# Altium project VSD FPGA.PrjPcb
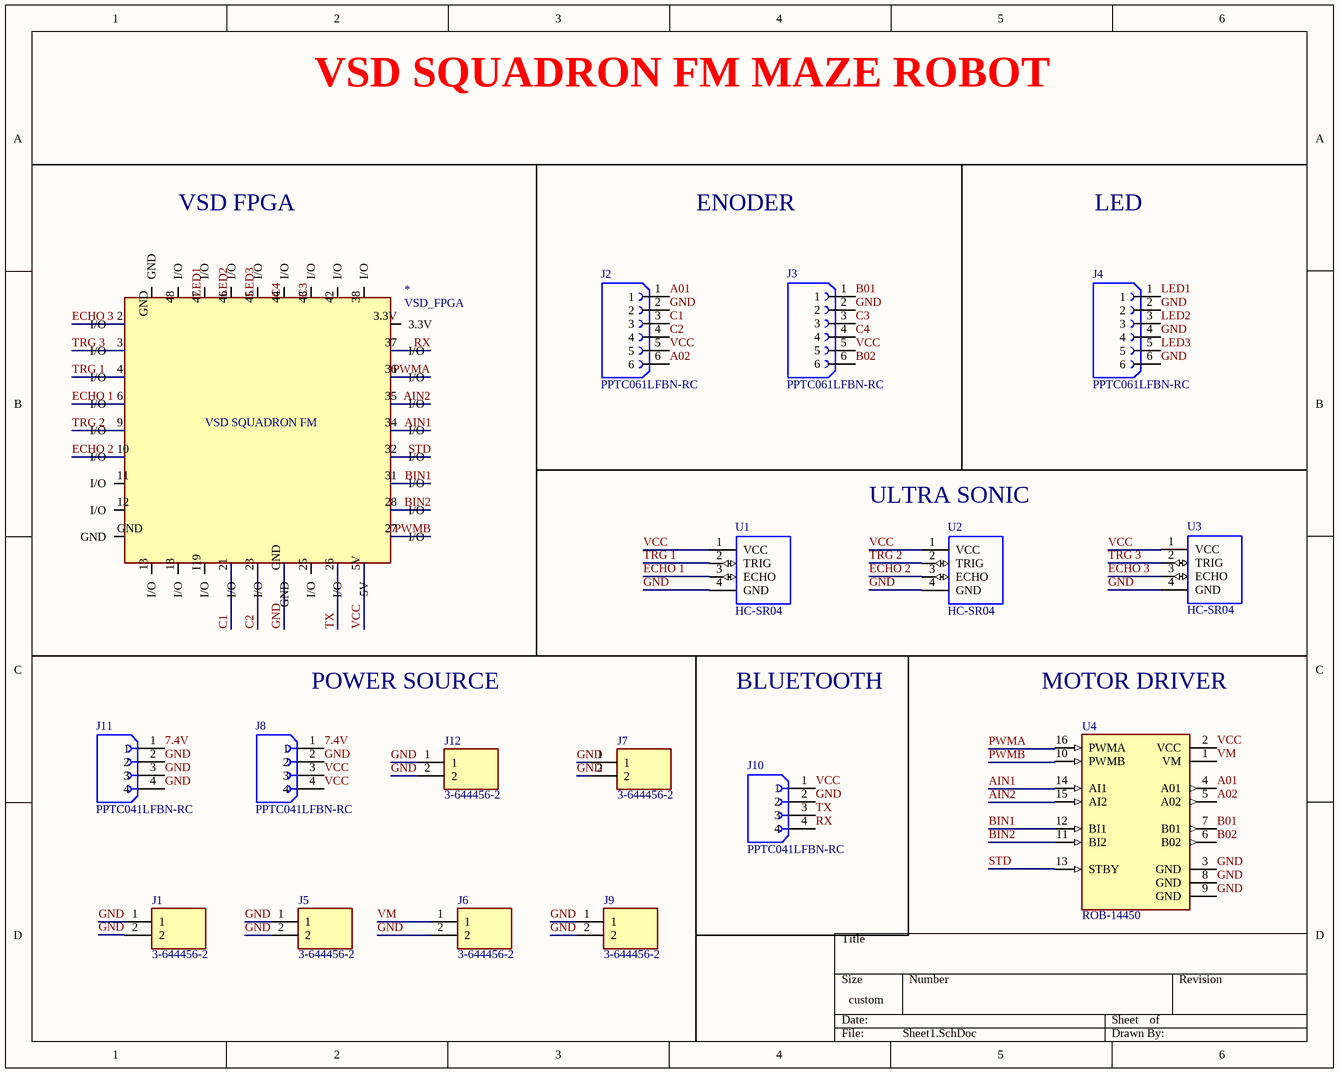
[diagram p0: Sheet1.SchDoc]
1 sheet, 17 parts. Net scope: global (net labels, ports and power ports of the same name join across sheets).
Board file: PCB1.PcbDoc

## Sheet Sheet1.SchDoc
size 250 x 199 mm; SheetNumber: 1; SheetTotal: 1

### Parts
*  VSD_FPGA  [VSD_FPGA2]
J1  3-644456-2  [TE_3-644456-2]
J2  PPTC061LFBN-RC  [SULLINS_PPTC061LFBN-RC]
J3  PPTC061LFBN-RC  [SULLINS_PPTC061LFBN-RC]
J4  PPTC061LFBN-RC  [SULLINS_PPTC061LFBN-RC]
J5  3-644456-2  [TE_3-644456-2]
J6  3-644456-2  [TE_3-644456-2]
J7  3-644456-2  [TE_3-644456-2]
J8  PPTC041LFBN-RC  [SULLINS_PPTC041LFBN-RC]
J9  3-644456-2  [TE_3-644456-2]
J10  PPTC041LFBN-RC  [SULLINS_PPTC041LFBN-RC]
J11  PPTC041LFBN-RC  [SULLINS_PPTC041LFBN-RC]
J12  3-644456-2  [TE_3-644456-2]
U1  HC-SR04  [XCVR_HC-SR04]
U2  HC-SR04  [XCVR_HC-SR04]
U3  HC-SR04  [XCVR_HC-SR04]
U4  ROB-14450  [MODULE_ROB-14450]

### Nets
7.4V: J8.1 J11.1
A01: J2.1 U4.4(A01)
A02: J2.6 U4.5(A02)
AIN1: *.34(I/O) U4.14(AI1)
AIN2: *.35(I/O) U4.15(AI2)
B01: J3.1 U4.7(B01)
B02: J3.6 U4.6(B02)
BIN1: *.31(I/O) U4.12(BI1)
BIN2: *.28(I/O) U4.11(BI2)
C1: *.21(I/O) J2.3
C2: *.23(I/O) J2.4
C3: *.43(I/O) J3.3
C4: *.44(I/O) J3.4
ECHO 1: *.6(I/O) U1.3(ECHO)
ECHO 2: *.10(I/O) U2.3(ECHO)
ECHO 3: *.2(I/O) U3.3(ECHO)
GND: *.GND J1.1 J1.2 J2.2 J3.2 J4.2 J4.4 J4.6 J5.1 J5.2 J6.2 J7.1 J7.2 J8.2 J9.1 J9.2 J10.2 J11.2 J11.3 J11.4 J12.1 J12.2 U1.4(GND) U2.4(GND) U3.4(GND) U4.3(GND) U4.8(GND) U4.9(GND)
LED1: *.47(I/O) J4.1
LED2: *.46(I/O) J4.3
LED3: *.45(I/O) J4.5
PWMA: *.36(I/O) U4.16(PWMA)
PWMB: *.27(I/O) U4.10(PWMB)
RX: *.37(I/O) J10.4
STD: *.32(I/O) U4.13(STBY)
TRG 1: *.4(I/O) U1.2(TRIG)
TRG 2: *.9(I/O) U2.2(TRIG)
TRG 3: *.3(I/O) U3.2(TRIG)
TX: *.26(I/O) J10.3
VCC: *.5V J2.5 J3.5 J8.3 J8.4 J10.1 U1.1(VCC) U2.1(VCC) U3.1(VCC) U4.2(VCC)
VM: J6.1 U4.1(VM)

Not connected (* = marked no-connect by the designer): * 3.3V 11(I/O) 12(I/O) 13(I/O) 18(I/O) 25(I/O) 38(I/O) 42(I/O) 48(I/O) I19(I/O)

### Notes on the sheet
- VSD SQUADRON FM MAZE ROBOT
- VSD FPGA
- ENODER
- LED
- (near U2) ULTRA SONIC
- POWER SOURCE
- BLUETOOTH
- MOTOR DRIVER
- (in symbol VSD_FPGA) VSD SQUADRON FM

### Library data of the parts
* = VSD_FPGA: VSD SQUADROM FM FPGA
J1 J5-J7 J9 J12 = 3-644456-2: HEADER ASSEMBLY, NARROW, MTA-100, 2 POSITION, STRAIGHT | TE Connectivity 3-644456-2; SnapEDA_Link: https://www.snapeda.com/parts/3-644456-2/TE+Connectivity+AMP+Connectors/view-part/?ref=snap; Package: None; Value: *; MF: TE Connectivity; MP: 3-644456-2; Check_prices: https://www.snapeda.com/parts/3-644456-2/TE+Connectivity+AMP+Connectors/view-part/?ref=eda
J2-J4 = PPTC061LFBN-RC: 6 Position Total Single Row 2.54 mm Pitch Straight Female Header; MF: Sullins Connector Solutions; MP: PPTC061LFBNRC; SnapEDA_Link: https://www.snapeda.com/parts/PPTC061LFBNRC/Sullins/view-part/?ref=snap; Package: None; Value: *; Check_prices: https://www.snapeda.com/parts/PPTC061LFBNRC/Sullins/view-part/?ref=eda
J8 J10 J11 = PPTC041LFBN-RC: 4 Position Header Connector 0.100 (2.54mm) Through Hole Tin; MF: Sullins Connector; SnapEDA_Link: https://www.snapeda.com/parts/PPTC041LFBN-RC/Sullins/view-part/?ref=snap; Package: None; Value: *; MP: PPTC041LFBN-RC; Check_prices: https://www.snapeda.com/parts/PPTC041LFBN-RC/Sullins/view-part/?ref=eda
U1-U3 = HC-SR04: Ultrasonic Sensor Module; Availability: Unavailable; MP: HC-SR04; Value: *; Price: None; Package: None
U4 = ROB-14450: TB6612FNG Motor Controller/Driver Power Management Evaluation Board; MF: SparkFun Electronics; Check_prices: https://www.snapeda.com/parts/ROB-14450/SparkFun%20Electronics/view-part/2656367/?ref=eda; Package: None; MP: ROB-14450; Value: *; Availability: In Stock; SnapEDA_Link: https://www.snapeda.com/parts/ROB-14450/SparkFun%20Electronics/view-part/2656367/?ref=snap; Price: None